# EAGLE design DAM1941_analog_V2 (EAGLE 9.4.2)

## Sheet 1 of 3
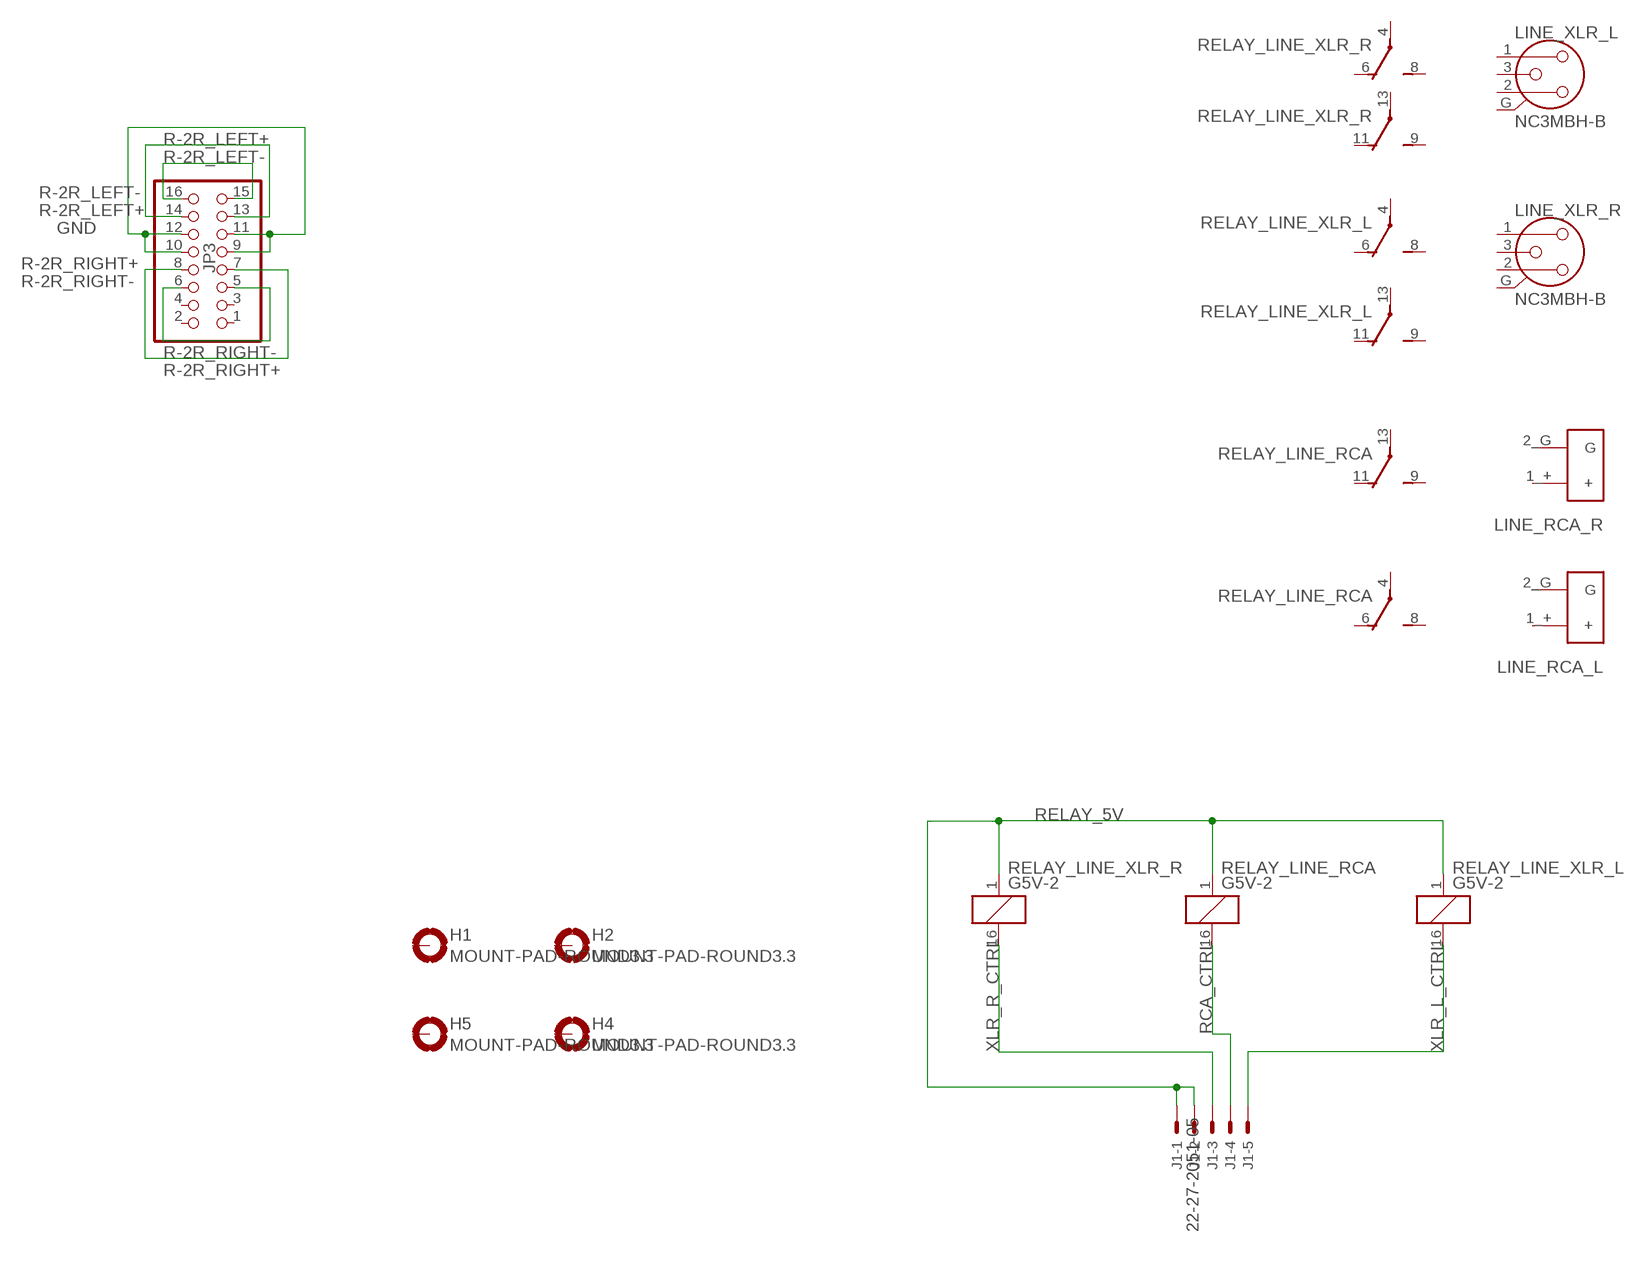
[diagram p0: schematic, sheet 1]

### Parts
H1  MOUNT-PAD-ROUND3.3  [3,3-PAD]
H2  MOUNT-PAD-ROUND3.3  [3,3-PAD]
H4  MOUNT-PAD-ROUND3.3  [3,3-PAD]
H5  MOUNT-PAD-ROUND3.3  [3,3-PAD]
J1  22-27-2051-05  [6410-05]
JP3  PINHD-2X8  [2X08]
LINE_RCA_L  RCA  [RCA]
LINE_RCA_R  RCA  [RCA]
LINE_XLR_L  NC3MBH-B  [NC3MBH-B]
LINE_XLR_R  NC3MBH-B  [NC3MBH-B]
RELAY_LINE_RCA  G5V-2  [G5V-2]
RELAY_LINE_XLR_L  G5V-2  [G5V-2]
RELAY_LINE_XLR_R  G5V-2  [G5V-2]

### Nets
GND: JP3.9 JP3.10 JP3.11 JP3.12 ; also sheet 2,3
R-2R_LEFT+: JP3.13 JP3.14
R-2R_LEFT-: JP3.15 JP3.16
R-2R_RIGHT+: JP3.7 JP3.8
R-2R_RIGHT-: JP3.5 JP3.6
RCA_CTRL: J1.4 RELAY_LINE_RCA.16
RELAY_5V: J1.1 J1.2 RELAY_LINE_RCA.1 RELAY_LINE_XLR_L.1 RELAY_LINE_XLR_R.1
XLR_L_CTRL: J1.5 RELAY_LINE_XLR_L.16
XLR_R_CTRL: J1.3 RELAY_LINE_XLR_R.16
Unconnected: H1.B3,3(MOUNT) H2.B3,3(MOUNT) H4.B3,3(MOUNT) H5.B3,3(MOUNT) JP3.1 JP3.2 JP3.3 JP3.4 LINE_RCA_L.1_+(+) LINE_RCA_L.2_G(G) LINE_RCA_R.1_+(+) LINE_RCA_R.2_G(G) LINE_XLR_L.1 LINE_XLR_L.2 LINE_XLR_L.3 LINE_XLR_L.G LINE_XLR_R.1 LINE_XLR_R.2 LINE_XLR_R.3 LINE_XLR_R.G RELAY_LINE_RCA.4(1:P) RELAY_LINE_RCA.6(1:O) RELAY_LINE_RCA.8(1:S) RELAY_LINE_RCA.9(2:S) RELAY_LINE_RCA.11(2:O) RELAY_LINE_RCA.13(2:P) RELAY_LINE_XLR_L.4(1:P) RELAY_LINE_XLR_L.6(1:O) RELAY_LINE_XLR_L.8(1:S) RELAY_LINE_XLR_L.9(2:S) RELAY_LINE_XLR_L.11(2:O) RELAY_LINE_XLR_L.13(2:P) RELAY_LINE_XLR_R.4(1:P) RELAY_LINE_XLR_R.6(1:O) RELAY_LINE_XLR_R.8(1:S) RELAY_LINE_XLR_R.9(2:S) RELAY_LINE_XLR_R.11(2:O) RELAY_LINE_XLR_R.13(2:P)

## Sheet 2 of 3
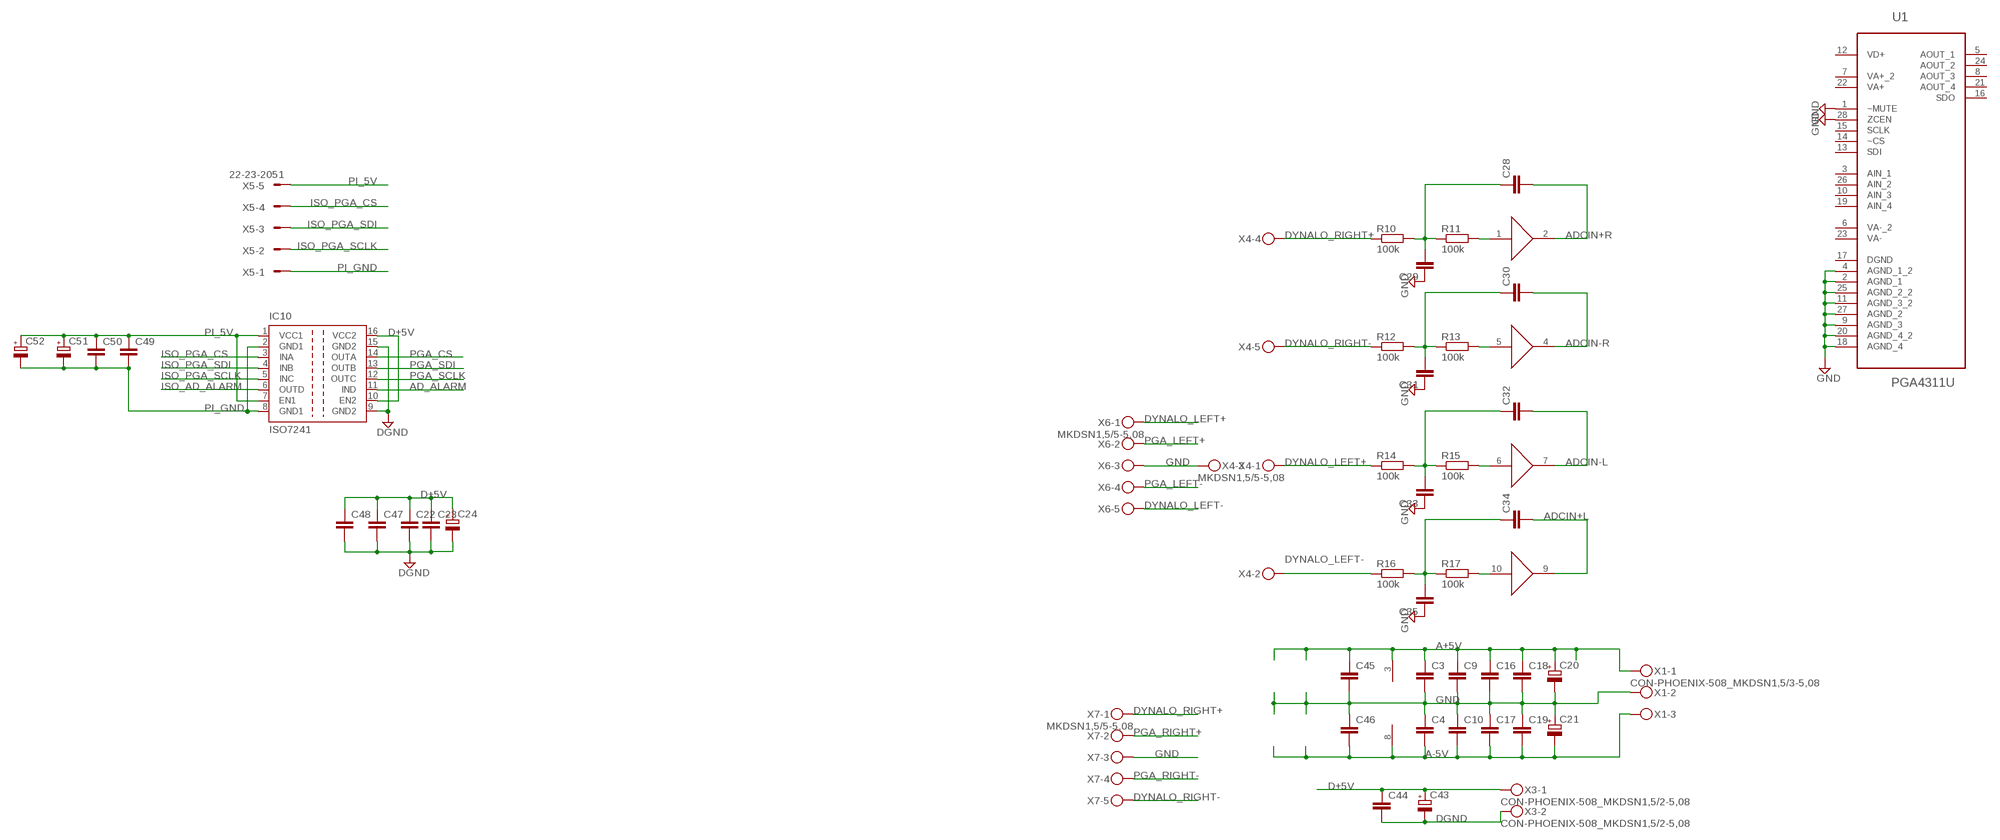
[diagram p1: schematic, sheet 2]

### Parts
C3  C-EU050-050X075  [C050-050X075]
C4  C-EU050-050X075  [C050-050X075]
C9  C-EU050-050X075  [C050-050X075]
C10  C-EU050-050X075  [C050-050X075]
C16  C-EU050-050X075  [C050-050X075]
C17  C-EU050-050X075  [C050-050X075]
C18  C-EU050-050X075  [C050-050X075]
C19  C-EU050-050X075  [C050-050X075]
C20  CPOL-EUE5-10.5  [E5-10,5]
C21  CPOL-EUE5-10.5  [E5-10,5]
C22  C-EU050-050X075  [C050-050X075]
C23  C-EU050-050X075  [C050-050X075]
C24  CPOL-EUE5-10.5  [E5-10,5]
C28  C-EUC1206  [C1206]
C29  C-EUC1206  [C1206]
C30  C-EUC1206  [C1206]
C31  C-EUC1206  [C1206]
C32  C-EUC1206  [C1206]
C33  C-EUC1206  [C1206]
C34  C-EUC1206  [C1206]
C35  C-EUC1206  [C1206]
C43  CPOL-EUE5-10.5  [E5-10,5]
C44  C-EU050-050X075  [C050-050X075]
C45  C-EUC0603K  [C0603K]
C46  C-EUC0603K  [C0603K]
C47  C-EUC0603K  [C0603K]
C48  C-EUC0603K  [C0603K]
C49  C-EUC0603K  [C0603K]
C50  C-EUC0603K  [C0603K]
C51  CPOL-EUE5-8.5  [E5-8,5]
C52  CPOL-EUE5-8.5  [E5-8,5]
IC10  ISO7241  [SO-16DW]
R10  100k  R-EU_MELF0204R  [MINI_MELF-0204R]
R11  100k  R-EU_MELF0204R  [MINI_MELF-0204R]
R12  100k  R-EU_MELF0204R  [MINI_MELF-0204R]
R13  100k  R-EU_MELF0204R  [MINI_MELF-0204R]
R14  100k  R-EU_MELF0204R  [MINI_MELF-0204R]
R15  100k  R-EU_MELF0204R  [MINI_MELF-0204R]
R16  100k  R-EU_MELF0204R  [MINI_MELF-0204R]
R17  100k  R-EU_MELF0204R  [MINI_MELF-0204R]
U1  PGA4311U  [SOIC127P1030X265-28N]
U$3  AD8244  [MSOP10]
X1  CON-PHOENIX-508_MKDSN1,5/3-5,08  [CON-PHOENIX-508_MKDSN1,5/3-5,08]
X3  CON-PHOENIX-508_MKDSN1,5/2-5,08  [CON-PHOENIX-508_MKDSN1,5/2-5,08]
X4  MKDSN1,5/5-5,08  [MKDSN1,5/5-5,08]
X5  22-23-2051  [22-23-2051]
X6  MKDSN1,5/5-5,08  [MKDSN1,5/5-5,08]
X7  MKDSN1,5/5-5,08  [MKDSN1,5/5-5,08]

### Nets
A+5V: C3.1 C9.1 C16.1 C18.1 C20.+ C45.1 U$3.3(V+) X1.1 ; also sheet 3
A-5V: C4.2 C10.2 C17.2 C19.2 C21.- C46.2 U$3.8(V-) X1.3
AD_ALARM: IC10.11(IND) ; also sheet 3
ADCIN+L: C34.2 U$3.9(OUT) ; also sheet 3
ADCIN+R: C28.2 U$3.2(OUT) ; also sheet 3
ADCIN-L: C32.2 U$3.7(OUT) ; also sheet 3
ADCIN-R: C30.2 U$3.4(OUT) ; also sheet 3
D+5V: C22.1 C23.1 C24.+ C43.+ C44.1 C47.1 C48.1 IC10.10(EN2) IC10.16(VCC2) X3.1 ; also sheet 3
DGND: C22.2 C23.2 C24.- C43.- C44.2 C47.2 C48.2 IC10.9(GND2) IC10.15(GND2) X3.2 ; also sheet 3
DYNALO_LEFT+: R14.1 X4.1 X6.1
DYNALO_LEFT-: R16.1 X4.2 X6.5
DYNALO_RIGHT+: R10.1 X4.4 X7.1
DYNALO_RIGHT-: R12.1 X4.5 X7.5
GND: C3.2 C4.1 C9.2 C10.1 C16.2 C17.1 C18.2 C19.1 C20.- C21.+ C29.1 C31.1 C33.1 C35.1 C45.2 C46.1 U1.1(~MUTE) U1.2(AGND_1) U1.4(AGND_1_2) U1.9(AGND_3) U1.11(AGND_3_2) U1.18(AGND_4) U1.20(AGND_4_2) U1.25(AGND_2_2) U1.27(AGND_2) U1.28(ZCEN) X1.2 X4.3 X6.3 X7.3 ; also sheet 1,3
ISO_AD_ALARM: IC10.6(OUTD) ; also sheet 3
ISO_PGA_CS: IC10.3(INA) X5.4
ISO_PGA_SCLK: IC10.5(INC) X5.2
ISO_PGA_SDI: IC10.4(INB) X5.3
N$25: C28.1 C29.2 R10.2 R11.1
N$26: R11.2 U$3.1(IN)
N$27: C30.1 C31.2 R12.2 R13.1
N$29: R13.2 U$3.5(IN)
N$31: C32.1 C33.2 R14.2 R15.1
N$32: R15.2 U$3.6(IN)
N$34: C34.1 C35.2 R16.2 R17.1
N$35: R17.2 U$3.10(IN)
PGA_CS: IC10.14(OUTA)
PGA_LEFT+: X6.2
PGA_LEFT-: X6.4
PGA_RIGHT+: X7.2
PGA_RIGHT-: X7.4
PGA_SCLK: IC10.12(OUTC)
PGA_SDI: IC10.13(OUTB)
PI_5V: C49.1 C50.1 C51.+ C52.+ IC10.1(VCC1) IC10.7(EN1) X5.5 ; also sheet 3
PI_GND: C49.2 C50.2 C51.- C52.- IC10.2(GND1) IC10.8(GND1) X5.1 ; also sheet 3
Unconnected: U1.3(AIN_1) U1.5(AOUT_1) U1.8(AOUT_3) U1.10(AIN_3) U1.13(SDI) U1.14(~CS) U1.15(SCLK) U1.16(SDO) U1.17(DGND) U1.19(AIN_4) U1.21(AOUT_4) U1.24(AOUT_2) U1.26(AIN_2)

## Sheet 3 of 3
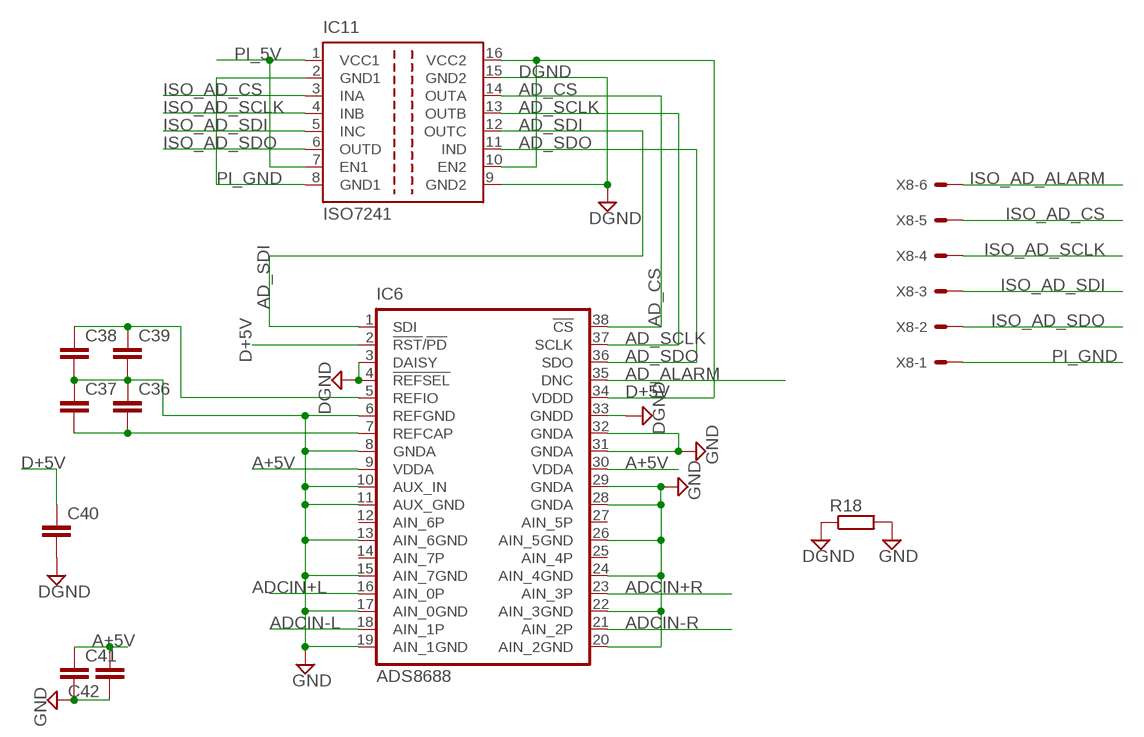
[diagram p2: schematic, sheet 3]

### Parts
C36  C-EUC0603K  [C0603K]
C37  C-EU050-035X075  [C050-035X075]
C38  C-EU050-035X075  [C050-035X075]
C39  C-EUC0603K  [C0603K]
C40  C-EUC0603K  [C0603K]
C41  C-EUC0603K  [C0603K]
C42  C-EUC0603K  [C0603K]
IC6  ADS8688  [DBT_R-PDSO-G38]
IC11  ISO7241  [SO-16DW]
R18  R-EU_MELF0204R  [MINI_MELF-0204R]
X8  22-23-2061  [22-23-2061]

### Nets
A+5V: C41.1 C42.2 IC6.9(VDDA) IC6.30(VDDA) ; also sheet 2
AD_ALARM: IC6.35(DNC) ; also sheet 2
AD_CS: IC6.38(!CS) IC11.14(OUTA)
AD_SCLK: IC6.37(SCLK) IC11.13(OUTB)
AD_SDI: IC6.1(SDI) IC11.12(OUTC)
AD_SDO: IC6.36(SDO) IC11.11(IND)
ADCIN+L: IC6.16(AIN_0P) ; also sheet 2
ADCIN+R: IC6.23(AIN_3P) ; also sheet 2
ADCIN-L: IC6.18(AIN_1P) ; also sheet 2
ADCIN-R: IC6.21(AIN_2P) ; also sheet 2
D+5V: C40.1 IC6.2(!RST!/!PD) IC6.34(VDDD) IC11.10(EN2) IC11.16(VCC2) ; also sheet 2
DGND: C40.2 IC6.3(DAISY) IC6.4(!REFSEL) IC6.33(GNDD) IC11.9(GND2) IC11.15(GND2) R18.1 ; also sheet 2
GND: C36.1 C37.1 C38.2 C39.2 C41.2 C42.1 IC6.6(REFGND) IC6.8(GNDA) IC6.10(AUX_IN) IC6.11(AUX_GND) IC6.13(AIN_6GND) IC6.15(AIN_7GND) IC6.17(AIN_0GND) IC6.19(AIN_1GND) IC6.20(AIN_2GND) IC6.22(AIN_3GND) IC6.24(AIN_4GND) IC6.26(AIN_5GND) IC6.28(GNDA) IC6.29(GNDA) IC6.31(GNDA) IC6.32(GNDA) R18.2 ; also sheet 1,2
ISO_AD_ALARM: X8.6 ; also sheet 2
ISO_AD_CS: IC11.3(INA) X8.5
ISO_AD_SCLK: IC11.4(INB) X8.4
ISO_AD_SDI: IC11.5(INC) X8.3
ISO_AD_SDO: IC11.6(OUTD) X8.2
N$30: C36.2 C37.2 IC6.7(REFCAP)
N$33: C38.1 C39.1 IC6.5(REFIO)
PI_5V: IC11.1(VCC1) IC11.7(EN1) ; also sheet 2
PI_GND: IC11.2(GND1) IC11.8(GND1) X8.1 ; also sheet 2
Unconnected: IC6.12(AIN_6P) IC6.14(AIN_7P) IC6.25(AIN_4P) IC6.27(AIN_5P)

## Power pins joined to a net without a drawn wire
VA+: U1.22(VA+)
VA+_2: U1.7(VA+_2)
VA-: U1.23(VA-)
VA-_2: U1.6(VA-_2)
VD+: U1.12(VD+)

## Library data of the parts
C3 C4 C9 C10 C16-C19 C22 C23 C28-C42 C44-C50 = Vwvwbg:C-EU: CAPACITOR, European symbol
C20 C21 C24 C43 C51 C52 = Vwvwbg:CPOL-EU: POLARIZED CAPACITOR, European symbol
H1 H2 H4 H5 = holes:MOUNT-PAD-ROUND: MOUNTING PAD, round
IC6 = texas:ADS8688: ADS868x 16-Bit, 500-kSPS, 8-Channel, Single-Supply, SAR ADCs with Bipolar Input Ranges Source: Data sheet <http://www.ti.com/lit/ds/symlink/ads8688.pdf>
IC10 IC11 = texas:ISO7241: HIGH SPEED QUAD DIGITAL ISOLATORS Source: http://focus.ti.com/lit/ds/symlink/iso7240m.pdf; MPN: ISO7241CDW; OC_FARNELL: 1575372; OC_NEWARK: 73M3155
J1 = con-molex:22-?-05: CONNECTOR wire to board 2.54 mm (.1 inch) pitch header; MF: MOLEX; OC_FARNELL: unknown; OC_NEWARK: unknown
JP3 = pinhead:PINHD-2X8: PIN HEADER
LINE_RCA_L LINE_RCA_R = Vwvwbg:RCA
LINE_XLR_L LINE_XLR_R = con-neutrik_ag:NC3: Neutrik Audio Connector XLR SERIES Stereo 1/4" jack Source: www.neutrik.com/; MPN: NC3MBH-B; OC_FARNELL: unknown; OC_NEWARK: 27B4288
R10-R18 = Vwvwbg:R-EU_: RESISTOR, European symbol
RELAY_LINE_RCA RELAY_LINE_XLR_L RELAY_LINE_XLR_R = relay:G5V-2: OMRON PCB Relay Source: http://www.omron.com/ecb/products/pdf/en-g5v2.pdf; MPN: G5V-2 5DC; OC_FARNELL: 9949488; OC_NEWARK: 78K5703
U1 = Texas Instruments_By_element14_Batch_1:PGA4311U: 4-channel audio volume control; MPN: PGA4311U; OC_FARNELL: 1212341; OC_NEWARK: 75C5439; PACKAGE: SOIC-28; SUPPLIER: Texas Instruments
U$3 = Vwvwbg:AD8244
X1 = Vwvwbg:CON-PHOENIX-508_MKDSN1,5/3-5,08: MKDSN 1,5/ 3-5,08 Printklemme Nennstrom: 13,5 A Nennspannung: 250 V Rastermaß: 5,08 mm Polzahl: 3 Anschlussart: Schraubanschluss Montage: Löten Anschlussrichtung Leiter/Platine: 0 ° Artikelnummer: 1729131 Source: http://eshop.phoenixcontact.com .. 1729131.pdf
X3 = Vwvwbg:CON-PHOENIX-508_MKDSN1,5/2-5,08: MKDSN 1,5/ 2-5,08 Printklemme Nennstrom: 13,5 A Nennspannung: 250 V Rastermaß: 5,08 mm Polzahl: 2 Anschlussart: Schraubanschluss Montage: Löten Anschlussrichtung Leiter/Platine: 0 ° Artikelnummer: 1729128 Source: http://eshop.phoenixcontact.com .. 1729128.pdf
X4 X6 X7 = Vwvwbg:MKDSN1,5/5-5,08: MKDSN 1,5/ 5-5,08 Printklemme Nennstrom: 13,5 A Nennspannung: 250 V Rastermaß: 5,08 mm Polzahl: 5 Anschlussart: Schraubanschluss Montage: Löten Anschlussrichtung Leiter/Platine: 0 ° Artikelnummer: 1729157 Source: http://eshop.phoenixcontact.com .. 1729157.pdf
X5 = con-molex:22-23-2051: .100" (2.54mm) Center Header - 5 Pin; MF: MOLEX; MPN: 22-23-2051; OC_FARNELL: 1462952; OC_NEWARK: 38C9178
X8 = con-molex:22-23-2061: .100" (2.54mm) Center Header - 6 Pin; MF: MOLEX; MPN: 22-23-2061; OC_FARNELL: 1462922; OC_NEWARK: 27C1933

## Board
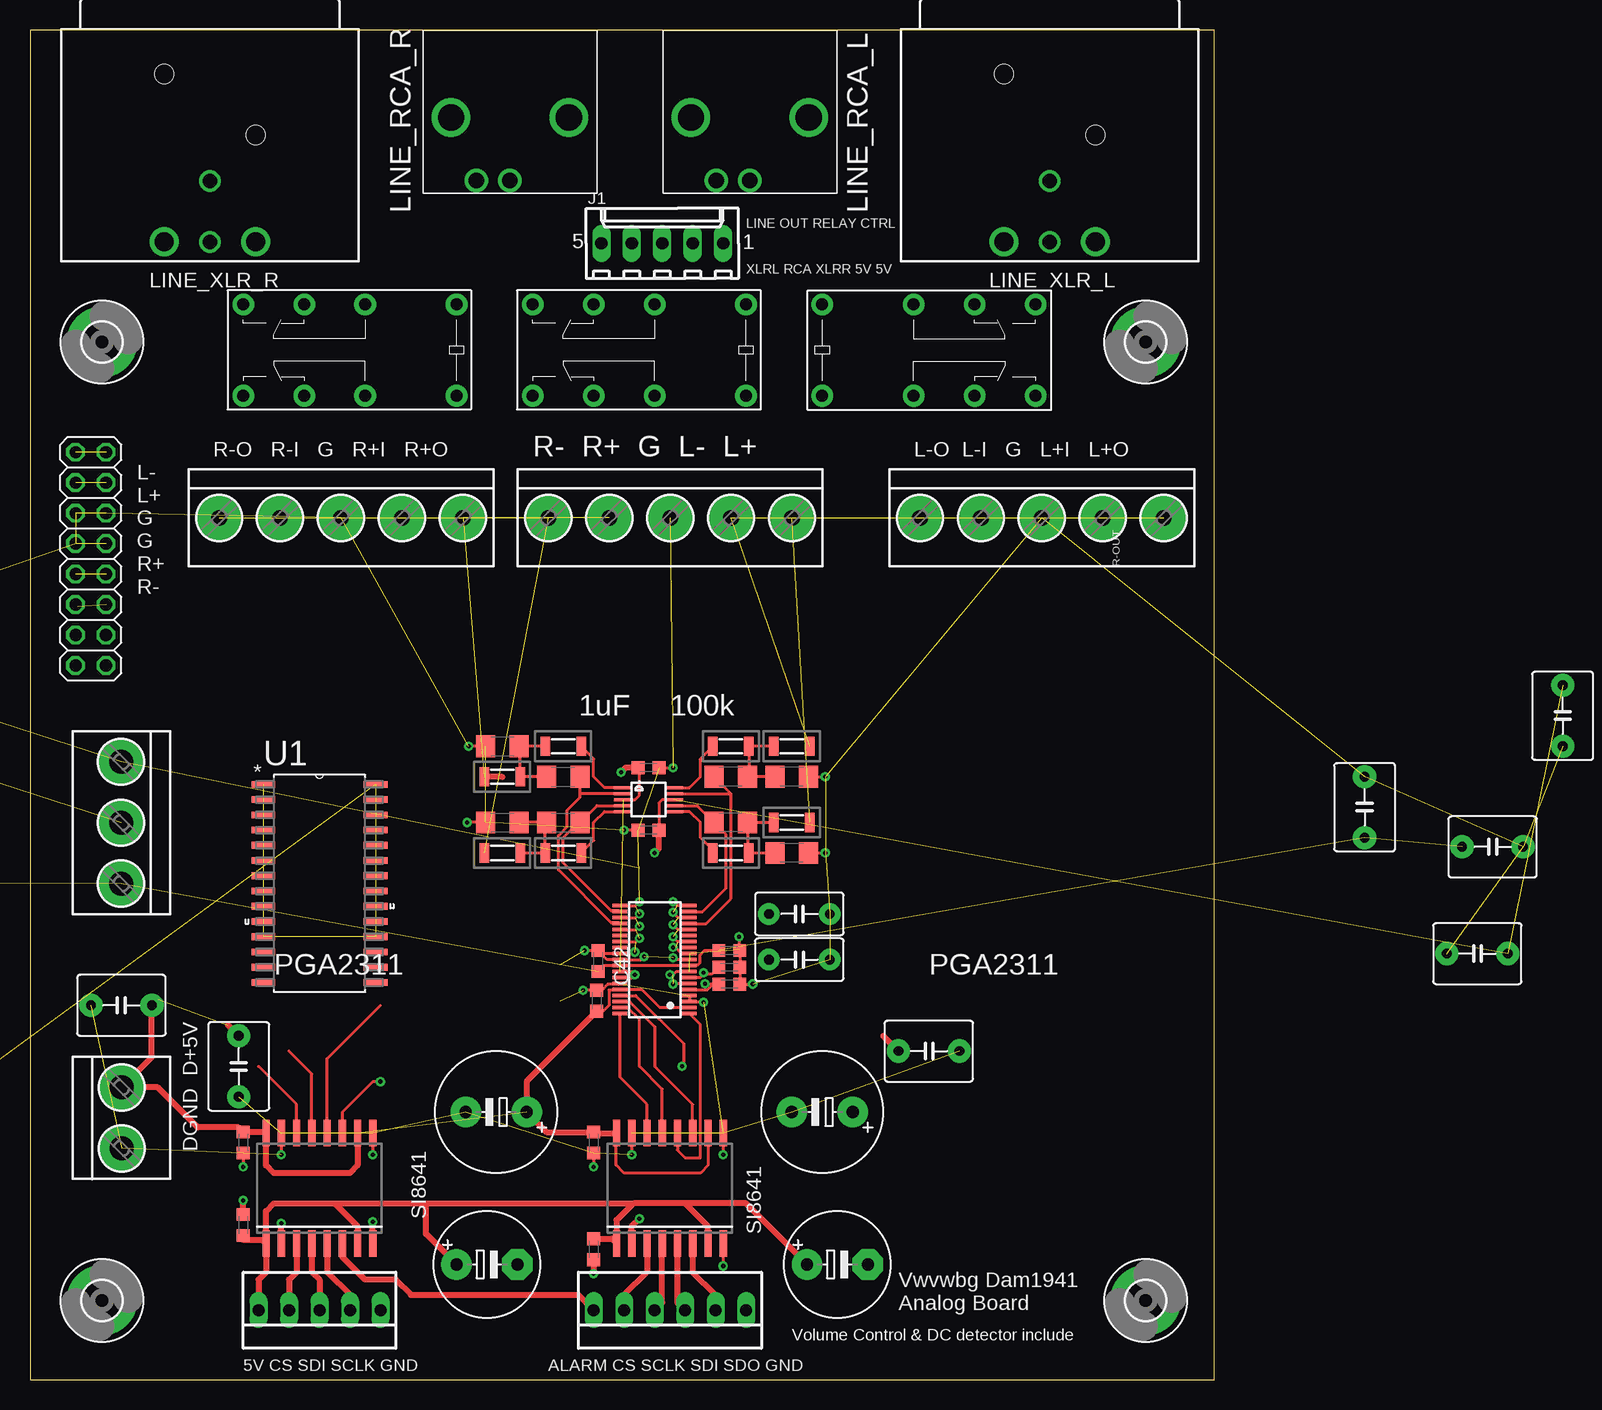
[diagram p3: board, top side]
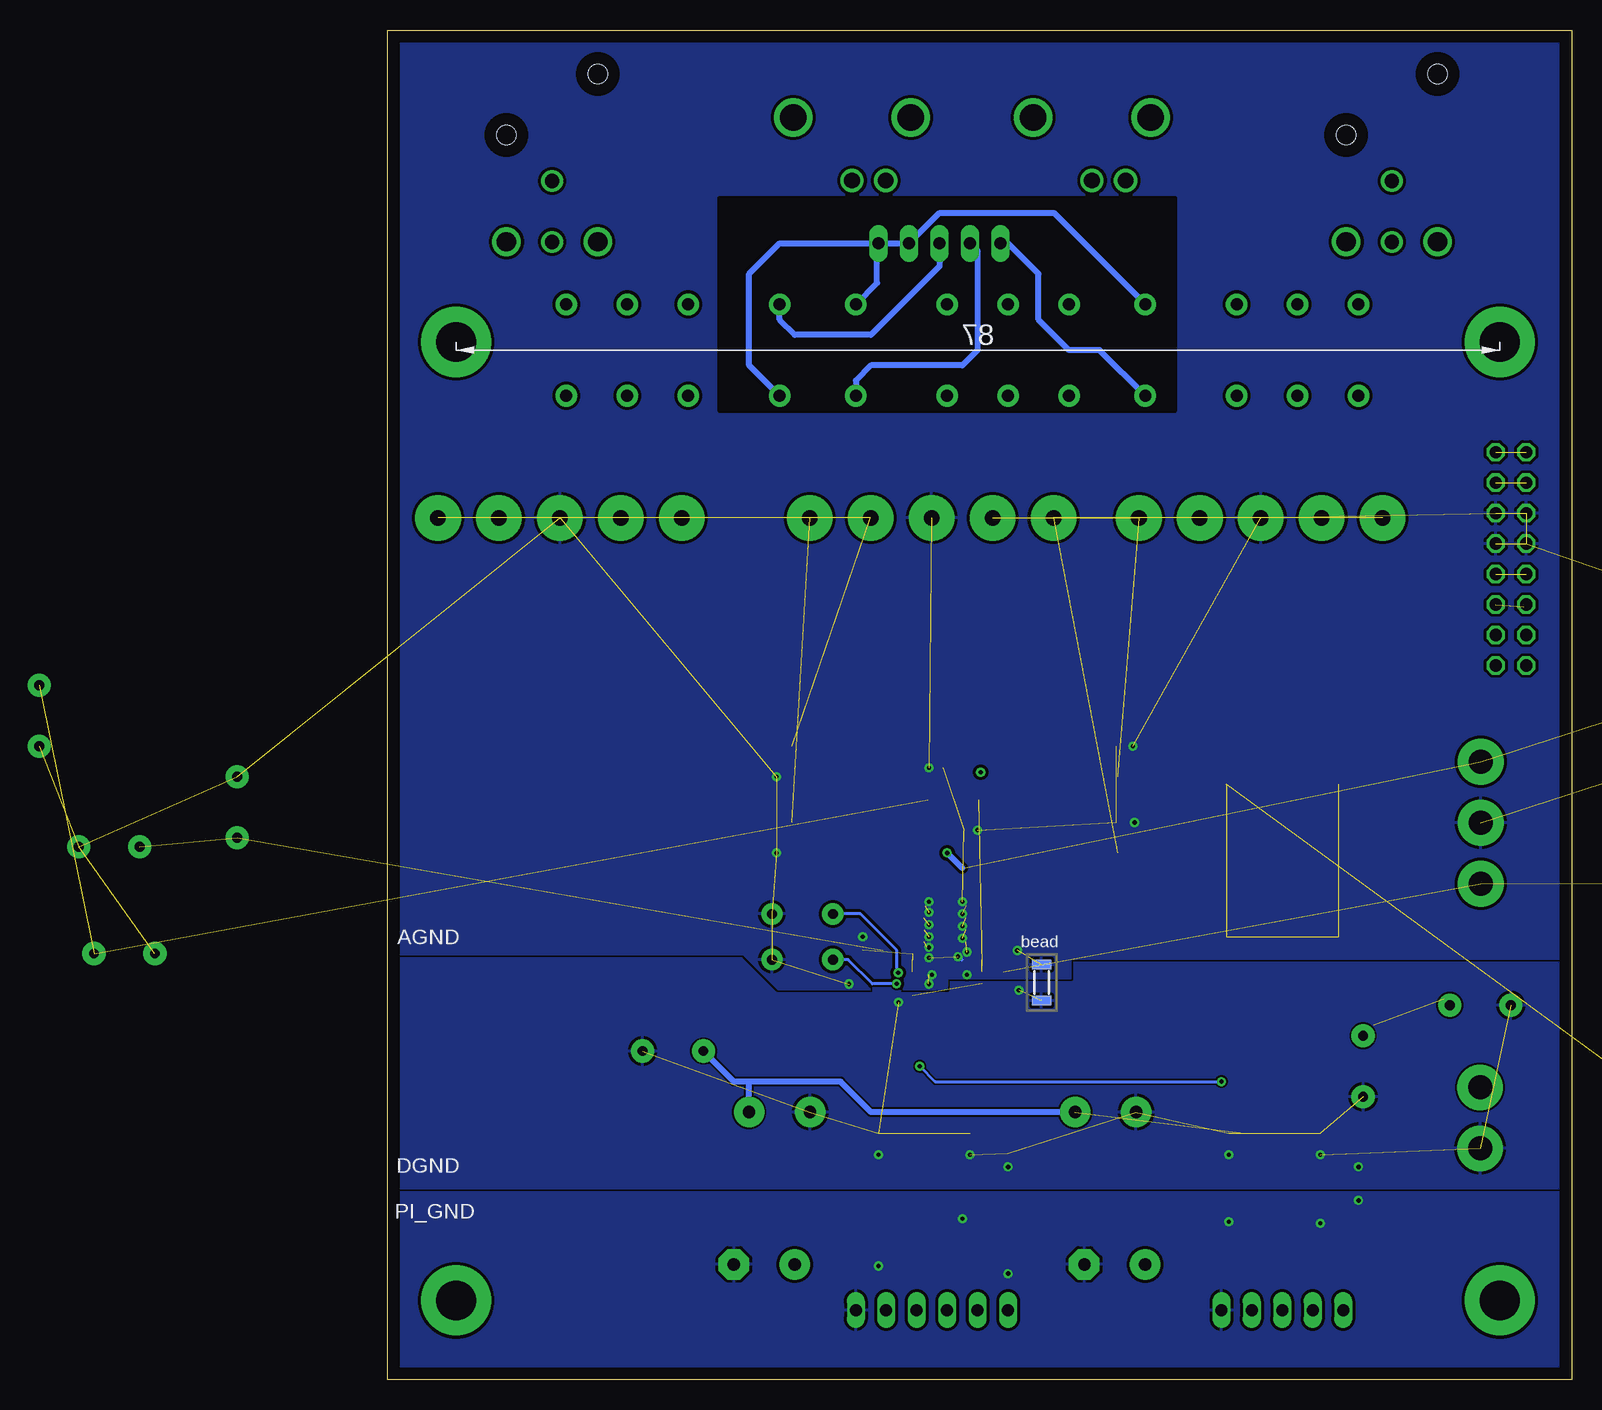
[diagram p4: board, bottom side, seen from below]

Size 98.73 x 112.47 mm. Coordinates in mm from the lower left corner, seen from the top.
Outline: 0,0 98.73,0 98.73,112.47 0,112.47 0,0
Copper layers (1*16): Top 0.035mm / dielectric 1.5mm / Bottom 0.035mm
Design rules "default *": minimum track width 6mil, minimum drill 0.35mm, track to track 6mil, track to pad 6mil, pad to pad 6mil, via to via 6mil, smd to smd 6mil, copper to edge 40mil, drill to drill 6mil, minimum pad ring 10mil, minimum via ring 8mil, stop-mask expansion 4mil, vias tented up to drill 0.36mm, thermal gap 10mil

### Footprints (pad centres in the part's own frame; a part is rotated, then mirrored left to right if it is on the bottom)
C050-050X075 = drill 0.813 pad 1.93: 1 -2.54,0; 2 2.54,0
E5-10,5 = drill 1.016 pad 2.54: + -2.54,0; - 2.54,0
C1206 = smd 1.6 x 1.8: 1 -1.4,0; 2 1.4,0
C0603K = smd 1.05 x 1.08: 1 -0.875,0; 2 0.875,0
C050-035X075 = drill 0.813 pad 1.778: 1 -2.54,0; 2 2.54,0
E5-8,5 = drill 1.016 pad 2.54: + -2.54,0 | drill 1.016 pad 2.54 octagon: - 2.54,0
3,3-PAD = drill 3.3 pad 5.842: B3,3 0,0
DBT_R-PDSO-G38 = smd 0.3 x 1.2: 1 -4.5,-2.9; 2 -4,-2.9; 3 -3.5,-2.9; 4 -3,-2.9; 5 -2.5,-2.9; 6 -2,-2.9; 7 -1.5,-2.9; 8 -1,-2.9; 9 -0.5,-2.9; 10 0,-2.9; 11 0.5,-2.9; 12 1,-2.9; 13 1.5,-2.9; 14 2,-2.9; 15 2.5,-2.9; 16 3,-2.9; 17 3.5,-2.9; 18 4,-2.9; 19 4.5,-2.9; 20 4.5,2.9; 21 4,2.9; 22 3.5,2.9; 23 3,2.9; 24 2.5,2.9; 25 2,2.9; 26 1.5,2.9; 27 1,2.9; 28 0.5,2.9; 29 0,2.9; 30 -0.5,2.9; 31 -1,2.9; 32 -1.5,2.9; 33 -2,2.9; 34 -2.5,2.9; 35 -3,2.9; 36 -3.5,2.9; 37 -4,2.9; 38 -4.5,2.9
SO-16DW = smd 0.6 x 2.2: 1 -4.445,-4.6; 2 -3.175,-4.6; 3 -1.905,-4.6; 4 -0.635,-4.6; 5 0.635,-4.6; 6 1.905,-4.6; 7 3.175,-4.6; 8 4.445,-4.6; 9 4.445,4.6; 10 3.175,4.6; 11 1.905,4.6; 12 0.635,4.6; 13 -0.635,4.6; 14 -1.905,4.6; 15 -3.175,4.6; 16 -4.445,4.6
6410-05 = drill 1.016 long: 1 5.08,0; 2 2.54,0; 3 0,0; 4 -2.54,0; 5 -5.08,0
2X08 = drill 1.016 octagon: 1 -8.89,-1.27; 2 -8.89,1.27; 3 -6.35,-1.27; 4 -6.35,1.27; 5 -3.81,-1.27; 6 -3.81,1.27; 7 -1.27,-1.27; 8 -1.27,1.27; 9 1.27,-1.27; 10 1.27,1.27; 11 3.81,-1.27; 12 3.81,1.27; 13 6.35,-1.27; 14 6.35,1.27; 15 8.89,-1.27; 16 8.89,1.27
RCA = drill 1.3: 1_+ 0,0; 2_G -2.8,0 | drill 2.2: 3_NC -4.9,5.25; 4_NC 4.9,5.25
NC3MBH-B = drill 1.6: 1 3.81,0; 2 -3.81,0 | drill 1.2: 3 0,0; G 0,5.08 | hole 1.6: -3.81,13.97; 3.81,8.89
MINI_MELF-0204R = smd 0.8 x 1.6: 1 -1.5,0; 2 1.5,0
G5V-2 = drill 1 pad 1.8: 1 -8.89,-3.81; 4 -1.27,-3.81; 6 3.81,-3.81; 8 8.89,-3.81; 9 8.89,3.81; 11 3.81,3.81; 13 -1.27,3.81; 16 -8.89,3.81
SOIC127P1030X265-28N = smd 1.981 x 0.559: 1 -4.674,8.255; 2 -4.674,6.985; 3 -4.674,5.715; 4 -4.674,4.445; 5 -4.674,3.175; 6 -4.674,1.905; 7 -4.674,0.635; 8 -4.674,-0.635; 9 -4.674,-1.905; 10 -4.674,-3.175; 11 -4.674,-4.445; 12 -4.674,-5.715; 13 -4.674,-6.985; 14 -4.674,-8.255; 15 4.674,-8.255; 16 4.674,-6.985; 17 4.674,-5.715; 18 4.674,-4.445; 19 4.674,-3.175; 20 4.674,-1.905; 21 4.674,-0.635; 22 4.674,0.635; 23 4.674,1.905; 24 4.674,3.175; 25 4.674,4.445; 26 4.674,5.715; 27 4.674,6.985; 28 4.674,8.255
MSOP10 = smd 0.25 x 1.5: 1 -1,-2.113; 2 -0.5,-2.113; 3 0,-2.113; 4 0.5,-2.113; 5 1,-2.113; 6 1,2.113; 7 0.5,2.113; 8 0,2.113; 9 -0.5,2.113; 10 -1,2.113
CON-PHOENIX-508_MKDSN1,5/3-5,08 = drill 2 pad 3.81: 1 -7.641,0.025; 2 -2.561,0.025; 3 2.519,0.025
CON-PHOENIX-508_MKDSN1,5/2-5,08 = drill 2 pad 3.81: 1 -2.561,0.025; 2 2.519,0.025
MKDSN1,5/5-5,08 = drill 1.3 pad 3.81: 1 -10.181,0.025; 2 -5.101,0.025; 3 -0.021,0.025; 4 5.059,0.025; 5 10.139,0.025
22-23-2051 = drill 1 long: 1 -5.08,0; 2 -2.54,0; 3 0,0; 4 2.54,0; 5 5.08,0
22-23-2061 = drill 1 long: 1 -6.35,0; 2 -3.81,0; 3 -1.27,0; 4 1.27,0; 5 3.81,0; 6 6.35,0

### Placement (x,y rotation side)
C3  121.92,44.4 0 top  (outside the outline)
C4  120.65,35.51 0 top  (outside the outline)
C9  -29.21,58.37 0 top  (outside the outline)
C10  -17.78,50.75 0 top  (outside the outline)
C16  111.25,47.7 90 top  (outside the outline)
C17  127.76,55.32 90 top  (outside the outline)
C18  -11.94,61.67 90 top  (outside the outline)
C19  -8.13,54.05 90 top  (outside the outline)
C20  -10.67,43.89 90 top  (outside the outline)
C21  -17.27,18.49 90 top  (outside the outline)
C22  74.93,27.38 0 top
C23  17.4,26.11 270 top
C24  38.86,22.3 180 top
C28  44.45,50.24 0 top
C29  39.37,52.78 0 top
C30  44.45,46.43 0 top
C31  39.37,46.43 0 top
C32  58.42,46.43 180 top
C33  63.5,43.89 180 top
C34  58.42,50.24 180 top
C35  63.5,50.24 180 top
C36  58.29,34.36 180 top
C37  64.14,38.81 180 top
C38  64.14,35 0 top
C39  58.29,32.97 0 top
C40  47.24,31.57 90 top
C41  58.29,35.76 0 top
C42  47.37,34.87 270 top
C43  66.04,22.3 180 top
C44  7.62,31.19 180 top
C45  51.56,51 0 top
C46  51.56,45.8 0 top
C47  17.78,19.76 270 top
C48  46.99,19.76 270 top
C49  46.99,10.87 270 top
C50  17.78,12.9 90 top
C51  67.31,9.6 0 top
C52  38.1,9.6 0 top
H1  6,6.6 0 top
H2  93,6.6 0 top
H4  6,86.47 0 top
H5  93,86.47 0 top
IC6  52.07,35 90 top
IC10  24.13,15.95 0 top
IC11  53.34,15.95 0 top
J1  52.7,94.69 0 top
JP3  5.07,68.4 90 top
LINE_RCA_L  60,99.92 0 top
LINE_RCA_R  40,99.92 0 top
LINE_XLR_L  85,94.82 0 top
LINE_XLR_R  15,94.82 0 top
R10  39.37,50.24 0 top
R11  44.45,52.78 0 top
R12  39.37,43.89 0 top
R13  44.45,43.89 0 top
R14  63.5,46.43 180 top
R15  58.42,43.89 180 top
R16  63.5,52.78 180 top
R17  58.42,52.78 180 top
R18  44.2,33.09 90 bottom
RELAY_LINE_RCA  50.8,85.8 180 top
RELAY_LINE_XLR_L  26.67,85.8 180 top
RELAY_LINE_XLR_R  74.93,85.8 0 top
U1  24.13,41.35 0 top
U$3  51.56,48.33 270 top
X1  7.62,48.97 90 top
X3  7.62,21.79 270 top
X4  53.34,71.83 180 top
X5  24.13,5.79 180 top
X6  84.33,71.83 180 top
X7  25.91,71.83 180 top
X8  53.34,5.79 180 top

### Tracks (layer width: path | path; a pad name or v marks a point on that pad's centre or on a via)
A+5V  (via drill 0.35)  (7 unrouted)
  Top 0.254: C42.2 47.87,34.5 IC6.30 IC6.9 55.04,34.57 55.69,34.57 55.85,34.73 55.85,35.38 56.23,35.76 C41.1 | U$3.3 50.42,48.33 50.8,48.72 50.8,50.89 C45.1
  Top 0.508: C45.1 49.66,51 v49.28,50.62
A-5V  (via drill 0.35)  (6 unrouted)
  Top 0.254: U$3.8 52.7,48.33 52.44,48.07 C46.2
  Top 0.508: v52.07,43.89 52.44,44.26 C46.2
  Bottom 0.508: C17.2 128.02,58.11 | 50.8,42.62 v52.07,43.89
AD_ALARM  (via drill 0.35)
  Top 0.254: IC6.35 50.5,32 54.48,28.02 54.48,26.11 v54.36,26.11 | v29.21,24.84 28.57,24.84 26.04,22.3 IC10.11
  Bottom 0.254: v54.36,26.11 53.09,24.84 v29.21,24.84
AD_CS
  Top 0.254: IC11.14 51.44,22.94 49.17,25.2 IC6.38
AD_SCLK
  Top 0.254: IC11.13 52.7,24.2 50.8,26.11 50.8,30.02 49.81,31 IC6.37
AD_SDI
  Top 0.254: IC11.12 53.98,19.12 54.61,18.49 55.88,18.49 55.88,29.59 IC6.1
AD_SDO
  Top 0.254: IC11.11 55.24,22.94 52.07,26.11 52.07,29.41 49.98,31.5 IC6.36
ADCIN+L
  Top 0.254: IC6.16 56.34,38 58.42,40.08 58.42,48.84 58.35,48.91 | 58.35,48.91 C34.2 | U$3.9 58.28,48.84 58.35,48.91
ADCIN+R
  Top 0.254: IC6.23 49.1,38.07 48.45,38.07 44.04,42.48 44.04,45.33 44.77,46.05 44.77,47.45 45.85,48.52 45.85,48.97 | 45.85,48.97 C28.2 | U$3.2 45.98,48.84 45.85,48.97
ADCIN-L
  Top 0.254: IC6.18 56.07,39 58.01,40.94 58.01,45.44 C32.2 55.62,47.83 U$3.7
ADCIN-R
  Top 0.254: IC6.21 49.1,39.07 48.45,39.07 44.45,43.08 44.45,45.16 45.72,46.43 C30.2 47.26,47.83 U$3.4
D+5V  (2 unrouted)
  Top 0.254: IC6.2 52.51,31 51.01,32.5 IC6.34 49.13,32.46 48.26,32.46 48.26,31.19 47.77,30.7 C40.1 | IC11.16 48.85,20.6 48.85,17.9 49.53,17.22 55.88,17.22 56.52,17.86 IC11.10
  Top 0.508: 10.67,31.7 C44.1 10.16,26.87 X3.1 10.65,24.35 13.97,21.03 17.39,21.03 C47.1 19.6,20.64 IC10.16 19.68,17.86 20.32,17.22 26.67,17.22 27.3,17.86 IC10.10 | C23.1 16.51,29.54 | 41.4,24.59 C24.+ | C24.+ 43.07,20.64 C48.1 47.08,20.55 IC11.16 | 71.12,28.65 C22.1 | C40.1 41.4,24.85 C24.+
  Bottom 0.508: 68.58,24.84 60.96,24.84 58.42,22.3 C24.+ | 68.58,24.84 69.85,24.84 C22.1 | C43.+ 68.58,24.84
DGND  (via drill 0.35)  (14 unrouted)
  Top 0.254: v46.1,32.46 46.12,32.45 C40.2 47.67,32.45 48.16,32.93 49.1,32.93 IC6.33 | IC6.4 IC6.3 56.08,31.5 v56.13,31.44 | IC11.9 v57.78,18.74 | IC11.15 v50.16,18.74 | C48.2 v46.99,17.73 | IC10.9 v28.57,18.74 | IC10.15 v20.95,18.74 | C47.2 v17.78,17.73
  pour Bottom (rank 2): -3.81,38.81 101.6,38.81 101.6,13.41 -3.81,13.41
DYNALO_LEFT+  (2 unrouted)
  Bottom 0.508: 94.51,71.09 X6.1
DYNALO_LEFT-  (2 unrouted)
DYNALO_RIGHT+  (2 unrouted)
  Top 0.508: 39.37,50.24 R10.1
DYNALO_RIGHT-  (2 unrouted)
GND  (via drill 0.35)  (51 unrouted)
  Top 0.254: IC6.6 53.63,33 v53.59,32.97 | IC6.8 53.86,34 53.59,33.73 v53.34,33.73 | IC6.31 50.15,34 v50.42,33.73 50.19,33.5 IC6.32 | C42.1 48.12,35 IC6.29 50.93,35 v51.18,35.25 | C42.1 47.62,35.5 IC6.28 50.28,35.5 v50.42,35.64 | C42.1 46.24,35.75 v46.23,35.76 | IC6.26 50.52,36.5 v50.8,36.78 | IC6.24 50.51,37.5 v50.8,37.79 | IC6.22 50.49,38.5 v50.8,38.81 | IC6.20 50.47,39.5 v50.8,39.83 | v53.59,36.02 53.81,36.02 54.33,35.5 IC6.11 | IC6.13 54,36.5 v53.59,36.91 | IC6.15 54.02,37.5 v53.59,37.92 | IC6.17 54.03,38.5 v53.59,38.94 | IC6.19 53.92,39.5 v53.59,39.83 | v59.11,36.91 59.11,35.82 C41.2 C36.1 C39.2 v60.25,32.97 | C33.1 v66.29,43.89 | C35.1 v66.29,50.24 | C31.1 v36.45,46.43 | C29.1 v36.58,52.78 | C46.1 v49.53,45.8 | C45.2 v53.59,51 | v53.59,35.16 53.75,35 IC6.10
  Bottom 0.254: v51.18,35.25 50.93,35 50.8,35
  pour Bottom (isolate 0.254): 52.07,32.59 52.07,33.48 41.78,33.48 41.78,35.13 0,35.13 0,112.47 100.08,112.47 100.08,35.51 69.09,35.51 66.17,32.59
  cutout Bottom: 71.12,98.5 71.12,80.72 33.02,80.72 33.02,98.5
ISO_AD_ALARM
  Top 0.508: IC10.6 26.04,10.23 27.94,8.33 30.48,8.33 31.75,7.06 45.72,7.06 X8.6
ISO_AD_CS
  Top 0.508: IC11.3 51.44,8.97 49.53,7.06 X8.5
ISO_AD_SCLK
  Top 0.508: IC11.4 52.7,6.42 X8.4
ISO_AD_SDI
  Top 0.508: IC11.5 53.98,6.42 X8.3
ISO_AD_SDO
  Top 0.508: IC11.6 55.24,8.97 57.15,7.06 X8.2
ISO_PGA_CS
  Top 0.508: IC10.3 22.23,8.97 21.59,8.33 X5.4
ISO_PGA_SCLK
  Top 0.508: IC10.5 24.77,8.97 26.67,7.06 X5.2
ISO_PGA_SDI
  Top 0.508: IC10.4 23.5,8.97 24.13,8.33 X5.3
N$25
  Top 0.254: R11.1 C29.2 40.87,52.68 R10.2 C28.1
N$26
  Top 0.254: U$3.1 47.9,49.34 46.99,50.24 46.99,51.74 R11.2
N$27
  Top 0.254: C31.2 C30.1 42.95,46.33 R13.1 R12.2
N$29
  Top 0.254: R13.2 46.99,44.93 46.99,46.43 47.9,47.33 U$3.5
N$30  (via drill 0.35)
  Top 0.254: C36.2 56.84,33.79 56.15,33.79 | IC6.7 55.86,33.5 56.15,33.79 | 56.15,33.79 v56.15,33.9
  Bottom 0.254: C37.2 59.31,38.81 56.26,35.76 56.26,34.01 v56.15,33.9
N$31
  Top 0.254: R14.2 C32.1 59.82,43.99 R15.1 C33.2
N$32
  Top 0.254: R15.2 56.92,44.12 55.88,45.16 55.88,46.43 54.98,47.33 U$3.6
N$33  (via drill 0.35)
  Top 0.254: IC6.5 56.49,32.5 57.19,33.2 C39.1 56.3,32.97 v56.28,32.99
  Bottom 0.254: v56.28,32.99 58.31,32.99 60.33,35 C38.1
N$34
  Top 0.254: C35.2 C34.1 59.92,50.34 R17.1 R16.2
N$35
  Top 0.254: U$3.10 54.98,49.34 55.88,50.24 55.88,51.74 R17.2
PGA_CS
  Top 0.254: IC10.14 22.23,22.94 19.05,26.11
PGA_SCLK
  Top 0.254: IC10.12 24.77,26.75 29.21,31.19
PGA_SDI
  Top 0.254: IC10.13 23.5,25.47 21.59,27.38
PI_5V
  Top 0.508: C50.1 17.78,11.63 19.4,11.63 IC10.1 | IC10.1 19.68,8.97 19.05,8.33 X5.5 | C49.1 48.5,11.75 IC11.1 48.9,13.28 50.29,14.68 | IC11.7 56.52,12.78 54.61,14.68 | 54.61,14.68 50.29,14.68 | IC10.1 19.68,14.05 20.32,14.68 25.4,14.68 | 25.4,14.68 27.3,12.78 IC10.7 | C51.+ 59.69,14.68 54.61,14.68 | 25.4,14.68 33.02,14.68 | 33.02,14.68 50.29,14.68 | C52.+ 33.02,12.14 33.02,14.68
PI_GND  (via drill 0.35)
  Top 0.254: IC11.8 v57.78,9.47
  Top 0.508: C49.2 v46.99,8.84 | C50.2 v17.78,14.93 | IC10.2 v20.95,13.03 | IC10.8 v28.57,13.16 | IC11.2 50.16,12.78 v50.8,13.41
  pour Bottom (isolate 0.254): 0,15.57 101.6,15.57 101.6,-25.96 0,-25.96
R-2R_LEFT+  (1 unrouted)
R-2R_LEFT-  (1 unrouted)
R-2R_RIGHT+  (1 unrouted)
R-2R_RIGHT-  (1 unrouted)
  Bottom 0.508: 6.54,64.39 JP3.5 | JP3.6 4,64.39
RCA_CTRL
  Bottom 0.508: J1.4 49.53,94.06 49.53,85.8 50.8,84.53 58.42,84.53 59.69,83.26 RELAY_LINE_RCA.16
RELAY_5V
  Bottom 0.508: RELAY_LINE_XLR_R.1 68.58,84.53 68.58,92.15 66.04,94.69 57.91,94.69 | 57.91,94.69 J1.1 J1.2 52.7,97.23 43.18,97.23 RELAY_LINE_XLR_L.1 | RELAY_LINE_RCA.1 57.91,91.39 57.91,94.69
XLR_L_CTRL
  Bottom 0.508: RELAY_LINE_XLR_L.16 39.37,85.8 41.91,85.8 44.45,88.34 44.45,92.15 46.99,94.69 J1.5
XLR_R_CTRL
  Bottom 0.508: J1.3 52.7,92.78 58.42,87.07 64.77,87.07 66.04,88.34 RELAY_LINE_XLR_R.16

### Text on the board
tPlace: LINE_RCA_R | LINE_RCA_L | LINE OUT RELAY CTRL | XLRL RCA XLRR 5V 5V | R-O R-I G R+I R+O | R- R+ G L- L+ | L-O L-I G L+I L+O | R-OUT | L- / L+ / G / G / R+ / R- | 1uF | 100k | PGA2311 | PGA2311 | DGND D+5V | SI8641 | SI8641 | Vwvwbg Dam1941 / Analog Board | Volume Control & DC detector include | 5V CS SDI SCLK GND | ALARM CS SCLK SDI SDO GND
bPlace: bead | AGND | DGND | PI_GND